# Altium schematic sheet Bi_Dir_Circuit.SchDoc
size A2; SheetNumber: 2; SheetTotal: 3
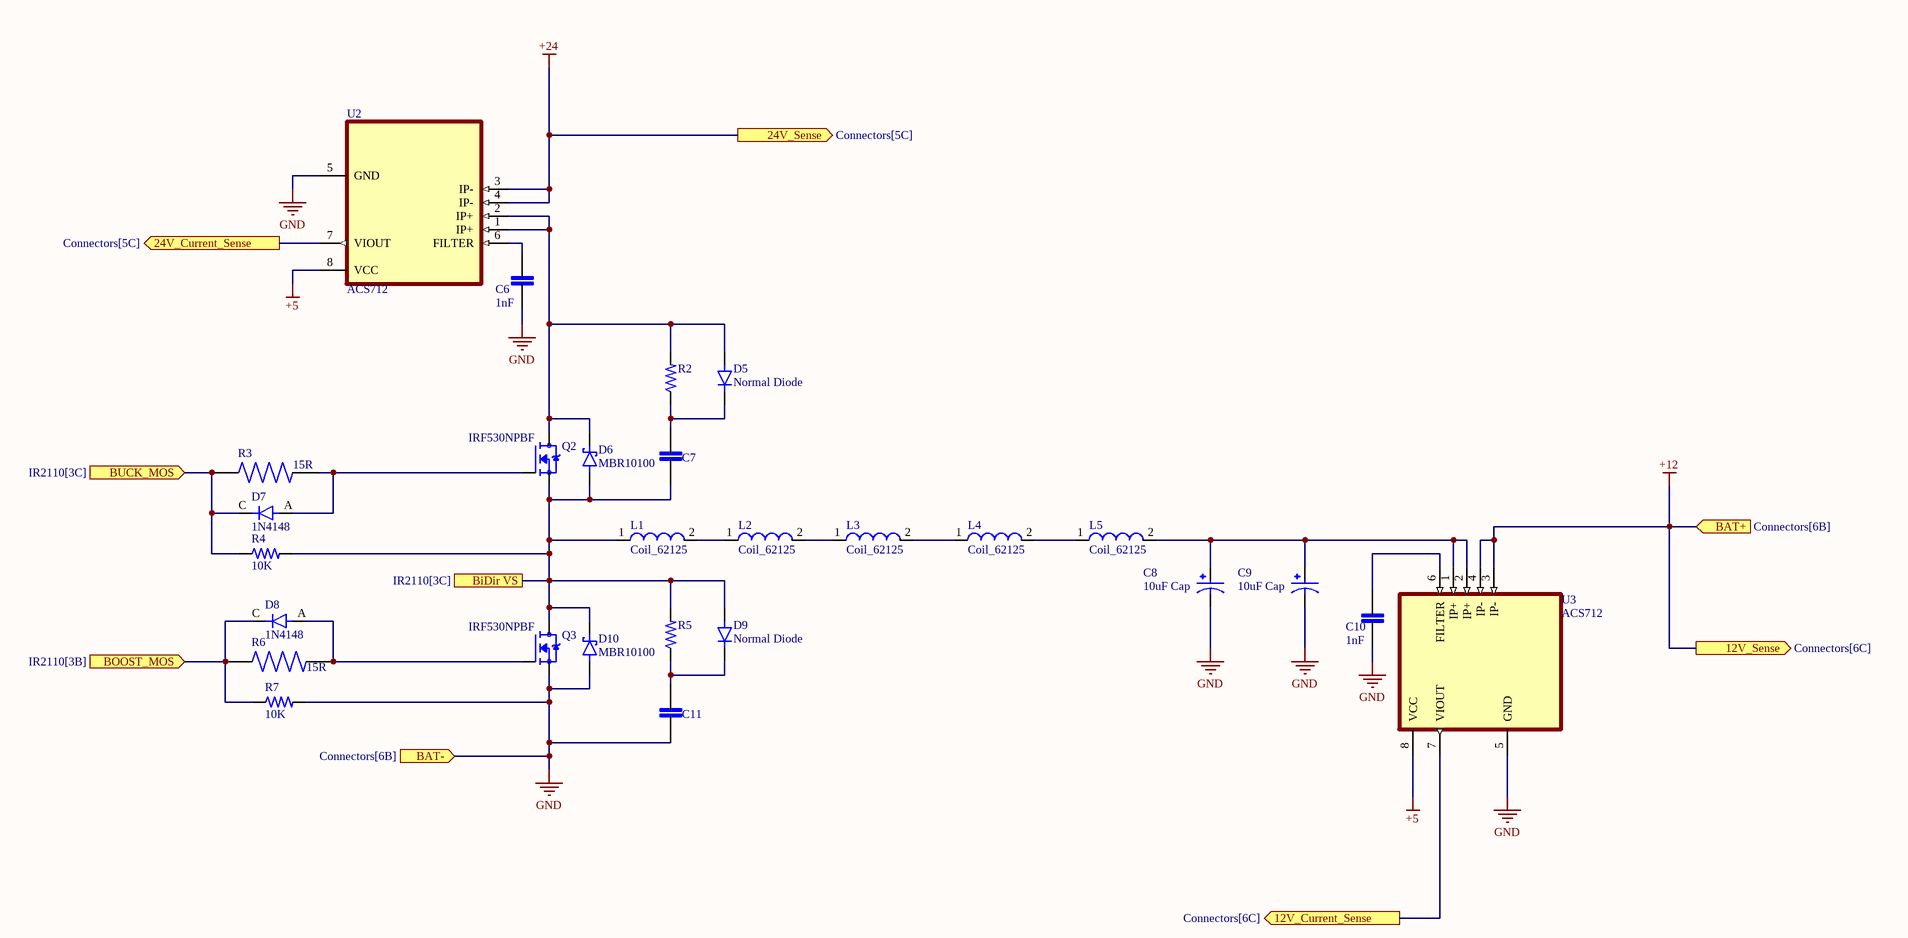
[diagram p0: Bi_Dir_Circuit.SchDoc]

## Parts
C6  1nF  [Ceramic Capacitor]
C7  Ceramic Capacitor  [Ceramic Capacitor]  (value not drawn)
C8  10uF Cap  [2200uF_Cap]
C9  10uF Cap  [2200uF_Cap]
C10  1nF  [Ceramic Capacitor]
C11  Ceramic Capacitor  [Ceramic Capacitor]  (value not drawn)
D5  Normal Diode  [Common Trhough Hole]
D6  MBR10100  [MBR10100]
D7  1N4148  [1N4007 DIODE]
D8  1N4148  [1N4007 DIODE]
D9  Normal Diode  [Common Trhough Hole]
D10  MBR10100  [MBR10100]
L1  Coil_62125  [Coil 65125]
L2  Coil_62125  [Coil 65125]
L3  Coil_62125  [Coil 65125]
L4  Coil_62125  [Coil 65125]
L5  Coil_62125  [Coil 65125]
Q2  IRF530NPBF  [IRF530N]
Q3  IRF530NPBF  [IRF530N]
R2  Resistor  [Resistor_Through Hole]  (value not drawn)
R3  15R  [Resistor_Through Hole]
R4  10K  [Resistor_Through Hole]
R5  Resistor  [Resistor_Through Hole]  (value not drawn)
R6  15R  [Resistor_Through Hole]
R7  10K  [Resistor_Through Hole]
U2  ACS712  [ACS712]
U3  ACS712  [ACS712]

## Ports
12V_Current_Sense (out, see Connectors[6C]), 12V_Sense (out, see Connectors[6C]), 24V_Current_Sense (out, see Connectors[5C]), 24V_Sense (out, see Connectors[5C]), BAT+ (in, see Connectors[6B]), BAT- (in, see Connectors[6B]), BiDir VS (see IR2110[3C]), BOOST_MOS (in, see IR2110[3B]), BUCK_MOS (in, see IR2110[3C])

## Nets
+5: U2.8(VCC) U3.8(VCC)
+12: U3.3(IP-) U3.4(IP-) ; port 12V_Sense, port BAT+
+24: U2.3(IP-) U2.4(IP-) ; port 24V_Sense
GND: C6.1 C8.N C9.N C10.1 C11.1 D10.3(A) Q3.3(S) R7.2 U2.5(GND) U3.5(GND) ; port BAT-
12V_Current_Sense: U3.7(VIOUT) ; port 12V_Current_Sense
24V_Current_Sense: U2.7(VIOUT) ; port 24V_Current_Sense
BiDir VS: C7.1 D6.3(A) D9.2(A) D10.1(K) L1.1 Q2.3(S) Q3.2(D) R4.2 R5.2 ; port BiDir VS
BOOST_MOS: D8.C R6.1 R7.1 ; port BOOST_MOS
BUCK_MOS: D7.C R3.1 R4.1 ; port BUCK_MOS
NetC6_2: C6.2 U2.6(FILTER)
NetC7_2: C7.2 D5.1(K) R2.1
NetC8_P: C8.P C9.P L5.2 U3.1(IP+) U3.2(IP+)
NetC10_2: C10.2 U3.6(FILTER)
NetC11_2: C11.2 D9.1(K) R5.1
NetD5_2: D5.2(A) D6.1(K) Q2.2(D) R2.2 U2.1(IP+) U2.2(IP+)
NetD7_A: D7.A Q2.1(G) R3.2
NetD8_A: D8.A Q3.1(G) R6.2
NetL1_2: L1.2 L2.1
NetL2_2: L2.2 L3.1
NetL3_2: L3.2 L4.1
NetL4_2: L4.2 L5.1

## Library data of the parts
C6 C7 C10 C11 = Ceramic Capacitor: MP: LD051A121KAB2A; MF: AVX; SnapEDA_Link: https://www.snapeda.com/parts/LD051A121KAB2A/AVX/view-part/?ref=snap; Package: 0805 AVX; Check_prices: https://www.snapeda.com/parts/LD051A121KAB2A/AVX/view-part/?ref=eda; Purchase-URL: https://pricing.snapeda.com/search/part/LD051A121KAB2A/?ref=eda; Price: None; Value: *; Availability: In Stock
C8 C9 = 10uF Cap: CAP ALUM 10UF 20% 50V RADIAL; MP: ECE-A1HN100UI; MF: Panasonic; SnapEDA_Link: https://www.snapeda.com/parts/ECE-A1HN100UI/Panasonic/view-part/2321690/?ref=snap; Price: None; Check_prices: https://www.snapeda.com/parts/ECE-A1HN100UI/Panasonic/view-part/2321690/?ref=eda; Value: *; Availability: In Stock; Package: RADIAL-2 Panasonic
D5 D9 = Normal Diode: MF: NTE Electronics, Inc.; MP: 1N4007; Package: DO-41 NTE Electronics; Check_prices: https://www.snapeda.com/parts/1N4007/NTE+Electronics/view-part/?ref=eda; Value: *; Purchase-URL: https://pricing.snapeda.com/search/part/1N4007/?ref=eda; Availability: In Stock; SnapEDA_Link: https://www.snapeda.com/parts/1N4007/NTE+Electronics/view-part/?ref=snap; Price: None
D6 D10 = MBR10100: MF: Diodes Inc.; MP: 1N5817-T; Package: DO-41 Diodes Inc.; Price: None; Check_prices: https://www.snapeda.com/parts/1N5817-T/Diodes+Inc./view-part/?ref=eda; Value: *; SnapEDA_Link: https://www.snapeda.com/parts/1N5817-T/Diodes+Inc./view-part/?ref=snap; Availability: In Stock; Purchase-URL: https://pricing.snapeda.com/search/part/1N5817-T/?ref=eda
D7 D8 = 1N4007: Diode Standard 1000 V 1A Through Hole DO-41; MF: NTE Electronics, Inc.; Package: DO-41 NTE Electronics; Check_prices: https://www.snapeda.com/parts/1N4007/NTE+Electronics/view-part/?ref=eda; Value: *; Purchase-URL: https://pricing.snapeda.com/search/part/1N4007/?ref=eda; Availability: In Stock; SnapEDA_Link: https://www.snapeda.com/parts/1N4007/NTE+Electronics/view-part/?ref=snap; MP: 1N4007; Price: None
L1-L5 = Coil_62125: Inductor Power Wirewound 470uH 10% 1KHz 25Q-Factor Ferrite 210mA 3.3Ohm DCR T/R; MF: Bourns; MP: SDR0604-471KL; Digi-Key_Part_Number: SDR0604-471KLCT-ND; Package: Nonstandard Bourns; Value: *; SnapEDA_Link: https://www.snapeda.com/parts/SDR0604-471KL/Bourns/view-part/567387/?ref=snap; Digi-Key_Purchase_URL: https://www.digikey.com/product-detail/en/bourns-inc/SDR0604-471KL/SDR0604-471KLCT-ND/2352941?utm_source=snapeda&utm_medium=aggregator&utm_campaign=symbol
Q2 Q3 = IRF530NPBF: RoHS Compliant | Low RDS(on) | Industry-leading quality | Dynamic dv/dt Rating | Fast Switching | Fully Avalanche Rated | 175C Operating Temperature; MF: Infineon Technologies; Purchase-URL: https://pricing.snapeda.com/search/part/IRF530NPBF/?ref=eda; Check_prices: https://www.snapeda.com/parts/IRF530NPBF/Infineon+Technologies/view-part/?ref=eda; SnapEDA_Link: https://www.snapeda.com/parts/IRF530NPBF/Infineon+Technologies/view-part/?ref=snap; Price: None; Availability: In Stock; Package: TO-220 Infineon; MP: IRF530NPBF; Value: *
R2 R4 R5 R7 = Resistor: Power_Rating: .25 W; MP: 2-2176053-0; Tolerance: 1%; Resistance: .33; MF: TE Connectivity; Price: None; Availability: In Stock; EU_RoHS_Compliance: Compliant with Exemptions; Package: 0805; Value: *; SnapEDA_Link: https://www.snapeda.com/parts/2-2176053-0/TE+Connectivity/view-part/?ref=snap; Check_prices: https://www.snapeda.com/parts/2-2176053-0/TE+Connectivity/view-part/?ref=eda
R3 R6 = Resistor_Through Hole: 1.02 Ohms Â±1% 0.25W, 1/4W Through Hole Resistor Axial Metal Film; MP: MFR-25FTE52-1R; MF: Yageo; Availability: Warning; Value: *; Check_prices: https://www.snapeda.com/parts/MFR-25FTE52-1R/Yageo/view-part/4629919/?ref=eda; Package: Axial Yageo; Price: None; SnapEDA_Link: https://www.snapeda.com/parts/MFR-25FTE52-1R/Yageo/view-part/4629919/?ref=snap; Purchase-URL: https://pricing.snapeda.com/search/part/MFR-25FTE52-1R/?ref=eda
U2 U3 = ACS712: Current Sensor 5A 1 Channel Hall Effect, Open Loop Bidirectional 8-SOIC (0.154, 3.90mm Width); MP: ACS712ELCTR-05B-T; MF: Allegro MicroSystems LLC; SnapEDA_Link: https://www.snapeda.com/parts/ACS712ELCTR-05B-T/Allegro+MicroSystems+LLC/view-part/?ref=snap; Package: SOIC-8 Allegro MicroSystems LLC; Check_prices: https://www.snapeda.com/parts/ACS712ELCTR-05B-T/Allegro+MicroSystems+LLC/view-part/?ref=eda; Purchase-URL: https://pricing.snapeda.com/search/part/ACS712ELCTR-05B-T/?ref=eda; Price: None; Value: *; Availability: In Stock